# EAGLE board DAM1941 (EAGLE 9.3.1)
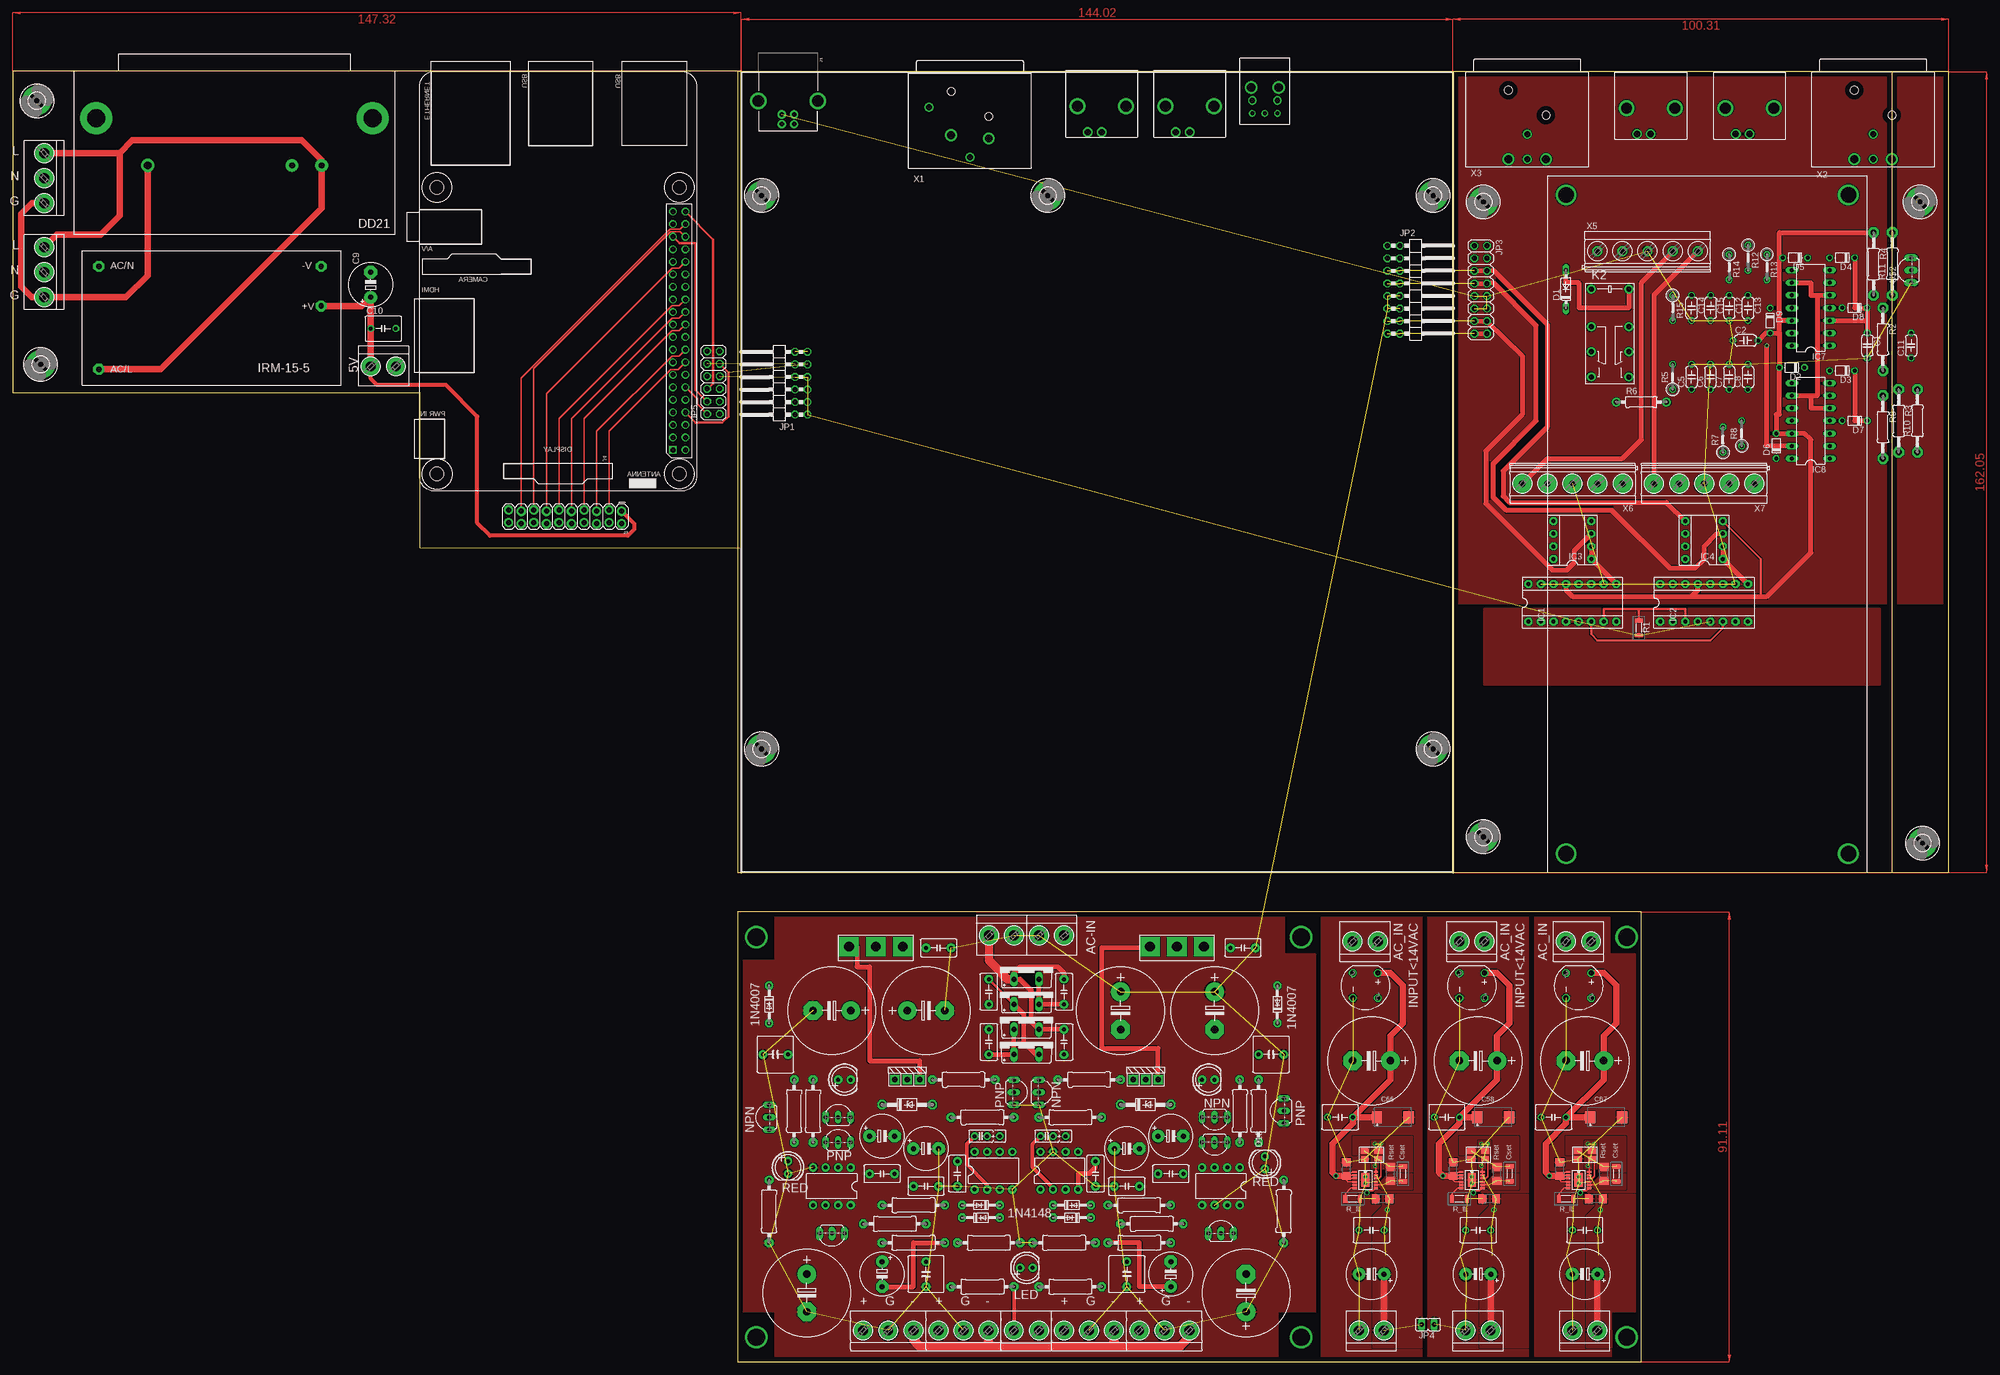
[diagram p7: board, top side]
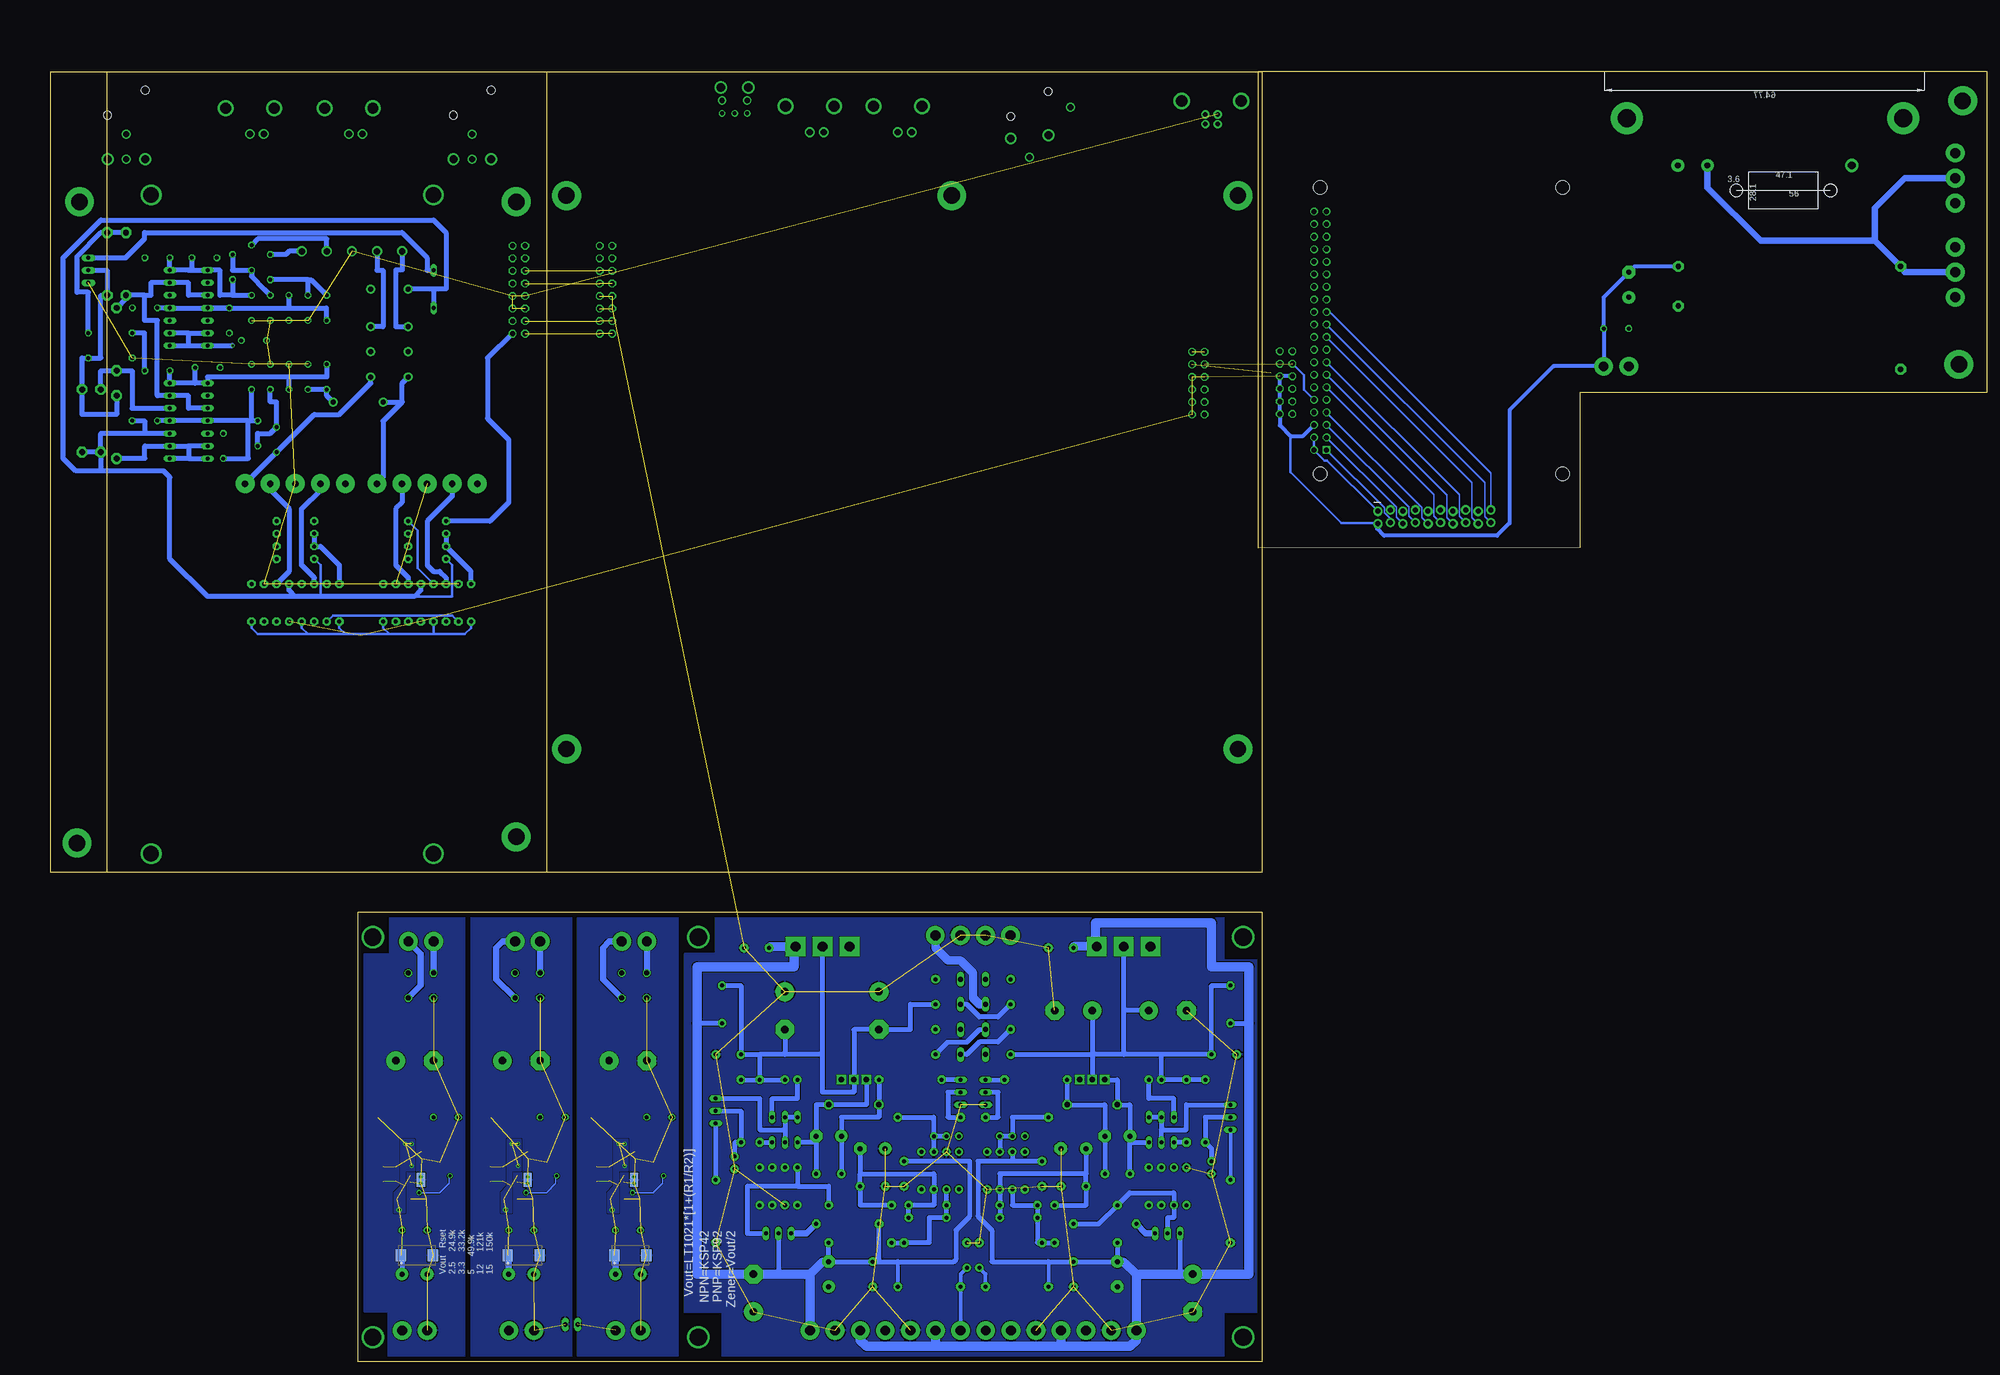
[diagram p8: board, bottom side, seen from below]

Size 391.77 x 261.24 mm. Coordinates in mm from the lower left corner, seen from the top.
Outline: 146.68,99.06 380.34,99.06 380.34,261.11 146.68,261.11 146.68,99.06
Outline: 291.46,99.06 391.77,99.06 391.77,261.11 291.46,261.11 291.46,99.06
Outline: 147.32,261.24 0,261.24 0,196.24 82.32,196.24 82.32,164.81 147.32,164.72 147.32,261.24
Outline: 146.68,0 329.6,0 329.6,91.11 146.68,91.11 146.68,0
Copper layers (1*16): Top 0.035mm / dielectric 1.5mm / Bottom 0.035mm
Design rules "default": minimum track width 6mil, minimum drill 0.35mm, track to track 6mil, track to pad 6mil, pad to pad 6mil, via to via 6mil, smd to smd 6mil, copper to edge 40mil, drill to drill 6mil, minimum pad ring 10mil, minimum via ring 8mil, stop-mask expansion 4mil, vias tented up to drill 0mil, thermal gap 10mil

## Footprints (pad centres in the part's own frame; a part is rotated, then mirrored left to right if it is on the bottom)
RB1A = drill 1.016: + -2.54,2.54 | drill 1.016 octagon: - 2.54,-2.54; AC1 2.54,2.54; AC2 -2.54,-2.54
C050-024X044 = drill 0.813 octagon: 1 -2.54,0; 2 2.54,0
C050-035X075 = drill 0.813 pad 1.778: 1 -2.54,0; 2 2.54,0
E5-8,5 = drill 1.016 pad 2.54: + -2.54,0 | drill 1.016 pad 2.54 octagon: - 2.54,0
C050-050X075 = drill 0.813 octagon: 1 -2.54,0; 2 2.54,0
C025_050-025X075 = drill 0.813 pad 1.524: 1 -1.27,0; 2 1.27,0; 3 3.81,0
C050-075X075 = drill 0.813 pad 1.778: 1 -2.54,0; 2 2.54,0
E7,5-18 = drill 1.5 pad 3.81: + -3.81,0 | drill 1.5 pad 3.81 octagon: - 3.81,0
C1206 = smd 1.6 x 1.8: 1 -1.4,0; 2 1.4,0
E5-10,5 = drill 1.016 pad 2.54: + -2.54,0; - 2.54,0
SP-CAP-CX = smd 2.062 x 2.4: + -2.754,0; - 3.707,0
DO35-7 = drill 0.813 long: A 3.81,0; C -3.81,0
D-5 = drill 0.813 octagon: A 2.54,0; C -2.54,0
LED5MM = drill 0.813 pad 1.676: A -1.27,0; K 1.27,0
DO41Z10 = drill 1.118 pad 1.93 octagon: A 5.08,0; C -5.08,0
1N4148 = drill 0.813 pad 1.676 octagon: A 3.81,0; C -3.81,0
DIL08 = drill 0.813 pad 1.676: 1 -3.81,-3.81; 2 -1.27,-3.81; 3 1.27,-3.81; 4 3.81,-3.81; 5 3.81,3.81; 6 1.27,3.81; 7 -1.27,3.81; 8 -3.81,3.81
TO220ACS = drill 1.016 long: A 2.54,-2.54; C -2.54,-2.54
3,3-PAD = drill 3.3 pad 5.842: B3,3 0,0
DIL16 = drill 0.813 pad 1.676 octagon: 1 -8.89,-3.81; 2 -6.35,-3.81; 3 -3.81,-3.81; 4 -1.27,-3.81; 5 1.27,-3.81; 6 3.81,-3.81; 7 6.35,-3.81; 8 8.89,-3.81; 9 8.89,3.81; 10 6.35,3.81; 11 3.81,3.81; 12 1.27,3.81; 13 -1.27,3.81; 14 -3.81,3.81; 15 -6.35,3.81; 16 -8.89,3.81
DIL08' = drill 0.813 pad 1.6 octagon: 1 -3.81,-3.81; 2 -1.27,-3.81; 3 1.27,-3.81; 4 3.81,-3.81; 5 3.81,3.81; 6 1.27,3.81; 7 -1.27,3.81; 8 -3.81,3.81
DIL14 = drill 0.813 long: 1 -7.62,-3.81; 2 -5.08,-3.81; 3 -2.54,-3.81; 4 0,-3.81; 5 2.54,-3.81; 6 5.08,-3.81; 7 7.62,-3.81; 8 7.62,3.81; 9 5.08,3.81; 10 2.54,3.81; 11 0,3.81; 12 -2.54,3.81; 13 -5.08,3.81; 14 -7.62,3.81
USB-B-PTH = drill 0.914 pad 1.676: D+ 4,1.25; D- 5.981,1.25; GND 4,-1.25; VBUS 5.981,-1.25 | drill 2.286: SHLD1 1.282,-6.02; SHLD2 1.282,6.02
2X10_LOCK = drill 1.016 pad 1.88: 1 0,0.127; 2 0,2.667; 3 2.54,-0.127; 4 2.54,2.413; 5 5.08,0.127; 6 5.08,2.667; 7 7.62,-0.127; 8 7.62,2.413; 9 10.16,0.127; 10 10.16,2.667; 11 12.7,-0.127; 12 12.7,2.413; 13 15.24,0.127; 14 15.24,2.667; 15 17.78,-0.127; 16 17.78,2.413; 17 20.32,0.127; 18 20.32,2.667; 19 22.86,-0.127; 20 22.86,2.413
2X06/90 = drill 1.016 octagon: 1 -6.35,-6.35; 2 -6.35,-3.81; 3 -3.81,-6.35; 4 -3.81,-3.81; 5 -1.27,-6.35; 6 -1.27,-3.81; 7 1.27,-6.35; 8 1.27,-3.81; 9 3.81,-6.35; 10 3.81,-3.81; 11 6.35,-6.35; 12 6.35,-3.81
2X08/90 = drill 1.016 octagon: 1 -8.89,-6.35; 2 -8.89,-3.81; 3 -6.35,-6.35; 4 -6.35,-3.81; 5 -3.81,-6.35; 6 -3.81,-3.81; 7 -1.27,-6.35; 8 -1.27,-3.81; 9 1.27,-6.35; 10 1.27,-3.81; 11 3.81,-6.35; 12 3.81,-3.81; 13 6.35,-6.35; 14 6.35,-3.81; 15 8.89,-6.35; 16 8.89,-3.81
2X08 = drill 1.016 octagon: 1 -8.89,-1.27; 2 -8.89,1.27; 3 -6.35,-1.27; 4 -6.35,1.27; 5 -3.81,-1.27; 6 -3.81,1.27; 7 -1.27,-1.27; 8 -1.27,1.27; 9 1.27,-1.27; 10 1.27,1.27; 11 3.81,-1.27; 12 3.81,1.27; 13 6.35,-1.27; 14 6.35,1.27; 15 8.89,-1.27; 16 8.89,1.27
JP1 = drill 0.914 long: 1 0,-1.27; 2 0,1.27
2X06 = drill 1.016 octagon: 1 -6.35,-1.27; 2 -6.35,1.27; 3 -3.81,-1.27; 4 -3.81,1.27; 5 -1.27,-1.27; 6 -1.27,1.27; 7 1.27,-1.27; 8 1.27,1.27; 9 3.81,-1.27; 10 3.81,1.27; 11 6.35,-1.27; 12 6.35,1.27
G5V-2 = drill 1 pad 1.8: 1 -8.89,-3.81; 4 -1.27,-3.81; 6 3.81,-3.81; 8 8.89,-3.81; 9 8.89,3.81; 11 3.81,3.81; 13 -1.27,3.81; 16 -8.89,3.81
RPI3 = drill 1.016 square: P$1 8.37,51.23 | drill 1.016: P$2 8.357,53.772; P$3 10.897,51.232; P$4 10.897,53.772; P$5 13.437,51.232; P$6 13.437,53.772; P$7 15.977,51.232; P$8 15.977,53.772; P$9 18.517,51.232; P$10 18.517,53.772; P$11 21.057,51.232; P$12 21.057,53.772; P$13 23.597,51.232; P$14 23.597,53.772; P$15 26.137,51.232; P$16 26.137,53.772; P$17 28.677,51.232; P$18 28.677,53.772; P$19 31.217,51.232; P$20 31.217,53.772; P$21 33.757,51.232; P$22 33.757,53.772; P$23 36.297,51.232; P$24 36.297,53.772; P$25 38.837,51.232; P$26 38.837,53.772; P$27 41.377,51.232; P$28 41.377,53.772; P$29 43.917,51.232; P$30 43.917,53.772; P$31 46.457,51.232; P$32 46.457,53.772; P$33 48.997,51.232; P$34 48.997,53.772; P$35 51.537,51.232; P$36 51.537,53.772; P$37 54.077,51.232; P$38 54.077,53.772; P$39 56.617,51.232; P$40 56.617,53.772 | hole 2.75: 3.5,3.5; 61.5,3.5; 3.5,52.5; 61.5,52.5
TO92-EBC = drill 0.813 long: B 0,-1.27; C 2.54,-1.27; E -2.54,-1.27
TO-264 = drill 2 pad 4 square: B -5.45,-6.096; C 0,-6.096; E 5.45,-6.096
TO220KG = drill 1.1 pad 1.93 square: 1 -2.54,0; 2 0,0; 3 2.54,0
TO92- = drill 0.813 pad 1.422 long: 1 2.54,0; 2 0,0; 3 -2.54,0
MINI_MELF-0204R = smd 0.8 x 1.6: 1 -1.5,0; 2 1.5,0
0207/12 = drill 1.2 pad 2.184 octagon: 1 -6.35,0; 2 6.35,0
0207/5V = drill 0.813 octagon: 1 -2.54,0; 2 2.54,0
0207/10 = drill 1 pad 1.778: 1 -5.08,0; 2 5.08,0
0309/12 = drill 0.813 pad 1.778 octagon: 1 -6.35,0; 2 6.35,0
RCA = drill 1.3: 1_+ 0,0; 2_G -2.8,0 | drill 2.2: 3_NC -4.9,5.25; 4_NC 4.9,5.25
TORX147 = drill 0.8: 1_VOUT -2.54,0; 2_GND 0,0; 3_VCC 2.54,0 | drill 1.1: 4_NC -2.54,2.625; 5_NC 2.54,2.625 | drill 1.7: P$1 -2.8,5.235; P$2 2.8,5.235
DYNALO17_DRILL = drill 3.2 pad 3.81: P$1 3.81,60.96; P$2 3.81,3.81; P$3 137.16,3.81; P$4 137.16,60.96
MSOP12 = smd 0.9 x 0.42: 1 -2.163,1.625; 2 -2.163,0.975; 3 -2.163,0.325; 4 -2.163,-0.325; 5 -2.163,-0.975; 6 -2.163,-1.625; 7 2.15,-1.625; 8 2.15,-0.975; 9 2.15,-0.325; 10 2.15,0.325; 11 2.15,0.975; 12 2.15,1.625 | smd 1.65 x 2.85: EXP 0,0 | smd 1.65 x 2.85 bottom: EXP1 0,0
DD21.NOCOVER = drill 1.2 pad 2.54: L 14.85,19.05; N 20.85,19.05 | drill 3.6 pad 6.452: P$1 4.5,9.5; P$2 60.5,9.5 | drill 1.6 pad 2.7: PE 50.05,19.05
LT3045CAP = smd 1.6 x 1.143: 3 -1.394,0.767; 4 -1.4,-0.776; 5 1.402,0.776; 6 1.403,-0.767
IRM-15 = drill 1.1 pad 2.184 octagon: +V 48.4,16; -V 48.4,24; AC/L 3.4,3.2; AC/N 3.4,24
NC3FAH2-0 = drill 1.6: 1 -3.81,0.635; 2 3.81,0 | drill 1.2: 3 0,-3.815; G -8.25,6.355 | hole 1.6: -3.81,9.525; 3.81,4.445
NC3MBH-B = drill 1.6: 1 3.81,0; 2 -3.81,0 | drill 1.2: 3 0,0; G 0,5.08 | hole 1.6: -3.81,13.97; 3.81,8.89
MKDSN1,5/3-5,08 = drill 2 pad 3.81: 1 -7.641,0.025; 2 -2.561,0.025; 3 2.519,0.025
MKDSN1,5/5-5,08 = drill 1.3 pad 2: 1 -10.181,0.025; 2 -5.101,0.025; 3 -0.021,0.025; 4 5.059,0.025; 5 10.139,0.025
MKDSN1,5/5-5,08' = drill 1.3 pad 3.81: 1 -10.181,0.025; 2 -5.101,0.025; 3 -0.021,0.025; 4 5.059,0.025; 5 10.139,0.025
CON-PHOENIX-508_MKDSN1,5/3-5,08 = drill 2 pad 3.81: 1 -7.641,0.025; 2 -2.561,0.025; 3 2.519,0.025
CON-PHOENIX-508_MKDSN1,5/2-5,08 = drill 2 pad 3.81: 1 -2.561,0.025; 2 2.519,0.025
MKDSN1,5/2-5,08 = drill 2 pad 3.81: 1 -2.561,0.025; 2 2.519,0.025

## Placement (x,y rotation side)
B1  [RB1A]  273.68,76.2 270 top
B3  [RB1A]  295.27,76.2 270 top
B5  [RB1A]  316.86,76.2 270 top
C1  [C050-024X044]  375.28,205.74 270 top
C2  [C050-024X044]  350.65,206.76 0 top
C3  [C050-035X075]  175.89,38.1 0 top
C4  47uF  [E5-8,5]  175.89,45.72 0 top
C5  [C050-024X044]  339.72,199.39 90 top
C6  [C050-024X044]  343.53,199.39 90 top
C7  [C050-024X044]  347.34,199.39 90 top
C8  [C050-024X044]  351.15,199.39 90 top
C9  [E5-8,5]  72.39,218.06 90 top
C10  [C050-050X075]  74.93,209.17 0 top
C11  [C050-024X044]  384.17,205.74 90 top
C12  [C050-024X044]  347.34,213.36 270 top
C13  [C050-024X044]  351.15,213.36 270 top
C14  [C050-024X044]  339.72,213.36 270 top
C15  [C050-024X044]  343.58,213.36 270 top
C16  47uF  [E5-8,5]  234.31,45.72 0 top
C17  [C050-035X075]  234.31,38.1 0 top
C18  47uF  [E5-8,5]  184.78,43.18 0 top
C19  [C050-035X075]  184.78,35.56 180 top
C20  47p  [C025_050-025X075]  195.9,45.72 0 top
C21  [C050-035X075]  225.42,35.56 0 top
C22  47uF  [E5-8,5]  225.42,43.18 0 top
C23  47p  [C025_050-025X075]  209.23,45.72 0 top
C24  10uF  [E5-8,5]  234.31,17.78 90 top
C25  10uF  [E5-8,5]  175.89,17.78 270 top
C26  4.7uF  [C050-075X075]  184.78,17.78 90 top
C27  [E7,5-18]  160.65,13.97 270 top
C28  [E7,5-18]  249.55,13.97 90 top
C29  4.7uF  [C050-075X075]  225.42,17.78 270 top
C30  [C050-035X075]  219.07,38.1 270 top
C31  [C050-035X075]  191.13,38.1 90 top
C32  [C050-035X075]  248.92,83.82 180 top
C33  [C050-075X075]  254.63,62.23 180 top
C34  [C050-075X075]  154.3,62.23 180 top
C35  [C050-035X075]  187.32,83.82 0 top
C36  [C050-035X075]  197.48,64.77 270 top
C37  [C050-035X075]  212.72,74.93 90 top
C38  [C050-035X075]  212.72,64.77 270 top
C39  [C050-035X075]  197.48,74.93 90 top
C40  [E7,5-18]  165.73,71.12 180 top
C41  [E7,5-18]  184.78,71.12 0 top
C42  [E7,5-18]  224.15,71.12 270 top
C43  [E7,5-18]  243.2,71.12 270 top
C44  [E7,5-18]  274.95,60.96 180 top
C45  [C1206]  278.76,38.1 90 top
C46  [C050-050X075]  268.6,49.53 180 top
C47  [C050-050X075]  274.95,26.67 180 top
C48  [E5-10,5]  274.95,17.78 180 top
C49  [C1206]  269.88,39.05 90 top
C50  [C1206]  277.18,33.02 180 top
C51  [E7,5-18]  296.54,60.96 180 top
C52  [C1206]  300.35,38.1 90 top
C53  [C050-050X075]  290.19,49.53 180 top
C54  [C050-050X075]  296.54,26.67 180 top
C55  [E5-10,5]  296.54,17.78 180 top
C56  [C1206]  291.46,39.05 90 top
C57  [C1206]  298.77,33.02 180 top
C58  [SP-CAP-CX]  299.08,49.53 0 top
C59  [E7,5-18]  318.13,60.96 180 top
C60  [C1206]  321.94,38.1 90 top
C61  [C050-050X075]  311.78,49.53 180 top
C62  [C050-050X075]  318.13,26.67 180 top
C63  [E5-10,5]  318.13,17.78 180 top
C64  [C1206]  313.05,39.05 90 top
C65  [C1206]  320.36,33.02 180 top
C66  [SP-CAP-CX]  278.76,49.53 0 top
C67  [SP-CAP-CX]  321.94,49.53 0 top
C68  [SP-CAP-CX]  318.13,21.59 0 bottom
C69  [SP-CAP-CX]  274.95,21.59 0 bottom
C70  [SP-CAP-CX]  296.54,21.59 0 bottom
D1  1N4148DO35-7  [DO35-7]  314.32,217.17 90 top
D2  [D-5]  360.02,201.27 180 top
D3  [D-5]  370.2,200.66 180 top
D4  [D-5]  370.2,223.52 180 top
D5  [D-5]  360.68,223.52 180 top
D6  [D-5]  356.87,185.42 90 top
D7  [D-5]  372.75,190.5 180 top
D8  [D-5]  372.72,213.38 180 top
D9  [D-5]  355.62,210.8 270 top
D10  [LED5MM]  168.27,57.15 0 top
D11  [LED5MM]  241.93,57.15 0 top
D12  1N4728  [DO41Z10]  180.97,52.07 0 top
D13  [LED5MM]  253.36,40.32 90 top
D14  [LED5MM]  156.84,39.37 270 top
D15  1N4728  [DO41Z10]  229.23,52.07 0 top
D16  1N4148-V  [1N4148]  255.9,72.39 90 top
D17  1N4148-V  [1N4148]  153.03,72.39 270 top
D18  LT1021  [DIL08]  244.47,35.56 180 top
D19  LT1021  [DIL08]  165.73,35.56 180 top
D20  1N4148-V  [1N4148]  214.31,31.75 0 top
D21  1N4148-V  [1N4148]  214.31,29.21 180 top
D22  1N4148-V  [1N4148]  195.9,31.75 180 top
D23  1N4148-V  [1N4148]  195.9,29.21 0 top
D24  [LED5MM]  205.1,19.05 0 top
D25  MUR810  [TO220ACS]  205.1,64.77 0 top
D26  MUR810  [TO220ACS]  205.1,80.01 0 top
D27  MUR810  [TO220ACS]  205.1,69.85 0 top
D28  MUR810  [TO220ACS]  205.1,74.93 0 top
H1  MOUNT-PAD-ROUND3.3  [3,3-PAD]  287.4,124.08 0 top
H2  MOUNT-PAD-ROUND3.3  [3,3-PAD]  151.51,124.08 0 top
H3  MOUNT-PAD-ROUND3.3  [3,3-PAD]  151.51,236.09 0 top
H4  MOUNT-PAD-ROUND3.3  [3,3-PAD]  287.4,236.09 0 top
H5  MOUNT-PAD-ROUND3.3  [3,3-PAD]  209.42,236.09 0 top
H6  MOUNT-PAD-ROUND3.3  [3,3-PAD]  297.56,106.3 0 top
H7  MOUNT-PAD-ROUND3.3  [3,3-PAD]  386.46,105.03 0 top
H8  MOUNT-PAD-ROUND3.3  [3,3-PAD]  297.56,234.82 0 top
H9  MOUNT-PAD-ROUND3.3  [3,3-PAD]  385.95,234.82 0 top
H12  MOUNT-PAD-ROUND3.3  [3,3-PAD]  4.83,255.27 0 top
H13  MOUNT-PAD-ROUND3.3  [3,3-PAD]  5.59,201.93 0 top
IC1  PGA2311P  [DIL16]  315.59,153.67 0 top
IC2  PGA2311P  [DIL16]  342.26,153.67 0 top
IC3  OPA2131P  [DIL08']  315.59,166.37 90 top
IC4  OPA2131P  [DIL08']  342.26,166.37 90 top
IC5  OPA134  [DIL08]  198.44,38.73 0 top
IC6  OPA134  [DIL08]  211.77,38.73 0 top
IC7  LM339N  [DIL14]  363.85,213.36 90 top
IC8  LM339N  [DIL14]  363.85,190.5 90 top
J1  USB_B_PTH  [USB-B-PTH]  156.84,256.54 270 top
J3  [2X10_LOCK]  123.19,172.34 180 top
JP1  [2X06/90]  154.43,198.12 90 top
JP2  [2X08/90]  284.48,217.04 270 top
JP3  [2X08]  297.03,217.04 270 top
JP4  [JP1]  286.38,7.62 90 top
JP5  [2X06]  141.75,198.25 90 top
K2  G5V-2  [G5V-2]  323.21,208.28 270 top
PCB2  RPI3  [RPI3]  82.32,176.24 90 bottom
Q1  [TO92-EBC]  167,50.8 0 top
Q2  [TO92-EBC]  243.2,48.26 180 top
Q3  [TO92-EBC]  167,45.72 0 top
Q4  MJW21194  [TO-264]  174.62,90.17 0 top
Q5  MJE15031  [TO220KG]  229.23,57.15 0 top
Q6  [TO92-EBC]  203.83,54.61 270 top
Q7  MJW21193  [TO-264]  235.58,90.17 0 top
Q8  DN2540  [TO92-]  165.73,26.03 180 top
Q9  MJE15030  [TO220KG]  180.97,57.15 0 top
Q10\  [TO92-EBC]  243.2,43.18 180 top
Q11  [TO92-EBC]  208.91,54.61 270 top
Q12  DN2540  [TO92-]  244.47,26.03 0 top
Q13  [TO92-EBC]  255.9,50.8 90 top
Q14  [TO92-EBC]  151.76,49.53 90 top
R1  100k  [MINI_MELF-0204R]  329.06,148.59 270 top
R2  500  [0207/12]  378.46,207.01 270 top
R3  11K  [0207/12]  381.63,190.5 270 top
R4  11K  [0207/12]  376.55,222.25 270 top
R5  100K  [0207/5V]  335.91,199.39 90 top
R6  100K  [0207/10]  329.56,194.31 0 top
R7  100K  [0207/5V]  346.07,186.69 90 top
R8  100K  [0207/5V]  349.88,187.96 90 top
R9  1K  [0207/12]  378.46,189.23 270 top
R10  100K  [0207/12]  385.44,190.5 90 top
R11  500K  [0207/12]  380.37,222.25 90 top
R12  100K  [0207/5V]  351.15,223.52 270 top
R13  100K  [0207/5V]  354.96,221.62 270 top
R14  100K  [0207/5V]  347.34,221.62 270 top
R15  100K  [0207/5V]  335.91,213.36 270 top
R16  150  [0309/12]  161.92,50.8 270 top
R17  1k  [0309/12]  153.03,30.48 270 top
R18  10  [0309/12]  192.4,57.15 0 top
R19  150  [0309/12]  248.28,50.8 90 top
R20  1k  [0309/12]  257.17,30.48 90 top
R21  10k  [0309/12]  158.11,50.8 270 top
R22  10k  [0309/12]  252.09,50.8 90 top
R23  10  [0309/12]  217.8,57.15 0 top
R24  10  [0309/12]  213.99,49.53 180 top
R25  10  [0309/12]  196.21,49.53 0 top
R26  R2  [0309/12]  197.48,24.13 180 top
R27  R1  [0309/12]  182.24,24.13 180 top
R28  R11  [0309/12]  227.96,24.13 180 top
R29  R12  [0309/12]  212.72,24.13 180 top
R30  1k  [0309/12]  178.43,27.94 180 top
R31  1k  [0309/12]  230.5,27.94 0 top
R32  RLED  [0309/12]  196.21,15.24 180 top
R33  RLED  [0309/12]  213.99,15.24 180 top
R34  500  [0309/12]  182.24,31.75 180 top
R35  500  [0309/12]  227.96,31.75 0 top
R36  [MINI_MELF-0204R]  281.3,38.1 270 top
R37  [MINI_MELF-0204R]  271.14,33.02 180 top
R38  [MINI_MELF-0204R]  302.89,38.1 270 top
R39  [MINI_MELF-0204R]  292.73,33.02 180 top
R40  [MINI_MELF-0204R]  324.48,38.1 270 top
R41  [MINI_MELF-0204R]  314.32,33.02 180 top
RCA1  RCA  [RCA]  220.34,248.92 0 top
RCA2  RCA  [RCA]  238.12,248.92 0 top
RCA3  RCA  [RCA]  331.46,248.56 0 top
RCA4  RCA  [RCA]  351.46,248.56 0 top
U$1  TORX147  [TORX147]  253.36,252.73 0 top
U$2  2N7000  [TO92-]  384.17,220.98 90 top
U$3  DYNALO_DRILL  [DYNALO17_DRILL]  375.28,99.06 90 top
U$4  LT3045  [MSOP12]  273.68,36.83 0 top
U$5  DD21  [DD21.NOCOVER]  77.32,261.24 180 top
U$6  LT3045CAP  [LT3045CAP]  274.95,41.91 180 top
U$7  IRM-15-5  [IRM-15]  13.97,197.74 0 top
U$8  LT3045  [MSOP12]  295.27,36.83 0 top
U$9  LT3045CAP  [LT3045CAP]  296.54,41.91 180 top
U$10  LT3045  [MSOP12]  316.86,36.83 0 top
U$11  LT3045CAP  [LT3045CAP]  318.13,41.91 180 top
X1  NC3FAH2-0  [NC3FAH2-0]  193.67,247.65 0 top
X2  NC3MBH-B  [NC3MBH-B]  376.46,243.46 0 top
X3  NC3MBH-B  [NC3MBH-B]  306.46,243.46 0 top
X4  MKDSN1,5/3-5,08  [MKDSN1,5/3-5,08]  235.58,6.35 0 top
X5  MKDSN1,5/5-5,08  [MKDSN1,5/5-5,08]  330.83,224.79 0 top
X6  MKDSN1,5/5-5,08  [MKDSN1,5/5-5,08']  315.59,177.8 180 top
X7  MKDSN1,5/5-5,08  [MKDSN1,5/5-5,08']  342.26,177.8 180 top
X8  MKDSN1,5/3-5,08  [MKDSN1,5/3-5,08]  220.34,6.35 0 top
X9  MKDSN1,5/3-5,08  [MKDSN1,5/3-5,08]  194.94,6.35 0 top
X10  CON-PHOENIX-508_MKDSN1,5/3-5,08  [CON-PHOENIX-508_MKDSN1,5/3-5,08]  6.35,242.19 90 top
X11  CON-PHOENIX-508_MKDSN1,5/3-5,08  [CON-PHOENIX-508_MKDSN1,5/3-5,08]  6.35,223.14 90 top
X12  CON-PHOENIX-508_MKDSN1,5/2-5,08  [CON-PHOENIX-508_MKDSN1,5/2-5,08]  74.93,201.55 180 top
X13  MKDSN1,5/3-5,08  [MKDSN1,5/3-5,08]  179.7,6.35 0 top
X14  MKDSN1,5/2-5,08  [MKDSN1,5/2-5,08]  205.1,6.35 0 top
X15  MKDSN1,5/2-5,08  [MKDSN1,5/2-5,08]  200.02,86.36 180 top
X16  MKDSN1,5/2-5,08  [MKDSN1,5/2-5,08]  210.18,86.36 180 top
X17  CON-PHOENIX-508_MKDSN1,5/2-5,08  [CON-PHOENIX-508_MKDSN1,5/2-5,08]  273.68,85.09 0 top
X18  CON-PHOENIX-508_MKDSN1,5/2-5,08  [CON-PHOENIX-508_MKDSN1,5/2-5,08]  274.95,6.35 0 top
X19  CON-PHOENIX-508_MKDSN1,5/2-5,08  [CON-PHOENIX-508_MKDSN1,5/2-5,08]  295.27,85.09 0 top
X20  CON-PHOENIX-508_MKDSN1,5/2-5,08  [CON-PHOENIX-508_MKDSN1,5/2-5,08]  296.54,6.35 0 top
X21  CON-PHOENIX-508_MKDSN1,5/2-5,08  [CON-PHOENIX-508_MKDSN1,5/2-5,08]  316.86,85.09 0 top
X22  CON-PHOENIX-508_MKDSN1,5/2-5,08  [CON-PHOENIX-508_MKDSN1,5/2-5,08]  318.13,6.35 0 top

## Tracks (layer width: path | path; a pad name or v marks a point on that pad's centre or on a via)
3
  Bottom 0.254: J3.6 119.43,170.99 119.43,173.01 PCB2.P$3
3V3
  Bottom 0.254: J3.4 120.65,170.74 121.87,171.96 121.87,172.93 PCB2.P$1
5
  Bottom 0.254: J3.8 116.89,171.25 116.89,173.01 PCB2.P$5
5V
  Top 0.813: J3.1 125.73,169.67 125.73,168.53 124.46,167.26 96.52,167.26 93.98,169.8 93.98,191.39 87.63,197.74 73.66,197.74 72.39,199.01 72.39,201.55
  Top 1.27: U$7.+V 70.61,213.74 C9.+ C10.1 72.39,201.55 X12.2
  Bottom 0.508: J3.1 133.48,182.5 133.99,182.5 PCB2.P$2 PCB2.P$4
7
  Bottom 0.254: J3.10 114.25,170.89 114.25,172.91 PCB2.P$7
11
  Bottom 0.254: J3.12 111.81,171.25 111.81,175.56 PCB2.P$11
13
  Bottom 0.254: J3.14 109.17,170.89 109.17,175.45 PCB2.P$13
15
  Bottom 0.254: J3.16 106.73,171.25 106.73,175.56 PCB2.P$15
19
  Bottom 0.254: PCB2.P$19 104.14,178.04 104.14,170.94 J3.18
21
  Bottom 0.254: PCB2.P$21 101.55,177.99 101.55,171.14 J3.20
23
  Bottom 0.254: J3.19 100.33,179.96 132.91,212.54 PCB2.P$23
A+5V
  Top 1.016: D3.C 372.75,190.5 D7.C | D4.C 372.75,213.36 375.24,213.36 D8.C 375.26,210.84 375.28,210.82 | 375.28,210.82 C1.1 | IC7.3 375.28,210.82
  Bottom 0.508: IC4.8 337.18,161.29 337.18,154.94 | IC3.8 310.51,161.29 310.51,154.94 318.13,154.94
  Bottom 1.016: 314.32,217.15 D1.C | 314.32,217.15 314.34,217.17 K2.1 | D3.C 372.76,200.68 372.76,208.28 C1.1 | 372.76,187.96 381.65,187.96 381.63,187.94 R3.2 | D7.C 372.76,190.5 372.76,187.96 | R3.2 R10.1 | R3.2 381.63,180.34 | 381.63,180.34 386.71,180.34 389.25,182.88 389.25,223.52 381.63,231.14 314.32,231.14 311.78,228.6 311.78,217.17 314.3,217.17 314.32,217.15 | IC1.12 316.86,156.21 318.13,154.94 337.18,154.94 342.26,154.94 | 342.26,154.94 343.53,156.21 IC2.12 | 342.26,154.94 360.04,154.94 367.66,162.56 367.66,179.07 368.93,180.34 381.63,180.34 | IC8.3 372.76,187.96
A-5V
  Top 0.508: IC4.4 353.69,162.56 353.69,154.94
  Top 1.016: 357.48,208.28 357.48,210.82 | 357.48,210.82 357.48,223.52 | 357.48,223.52 357.48,228.56 357.52,228.6 R4.1 | 357.48,208.28 D2.A 357.5,201.25 357.5,191.77 356.87,191.77 D6.A IC8.12 362.58,187.96 363.85,186.69 363.85,163.83 354.96,154.94 353.69,154.94 339.72,154.94 | IC7.12 357.48,210.82 | 357.48,208.28 357.46,208.26 D9.A 354.69,208.26 C2.2 | D5.A 357.48,223.52 | IC1.13 314.32,156.21 315.59,154.94 339.72,154.94 | 339.72,154.94 341,156.21 IC2.13
  Bottom 0.508: IC3.4 317.5,168.28 317.5,160.66 IC1.13
  Bottom 1.016: R4.1 R11.2 381.63,228.6 386.46,223.77 386.46,216.53 384.17,216.53 C11.2
AGND  (39 unrouted)
  pour Top: 154.3,92.71 257.17,92.71 257.22,82.55 263.52,82.55 263.52,10.16 255.9,10.16 255.9,0 154.3,0 154.3,10.16 145.41,10.16 145.41,81.28 154.3,81.28
  pour Bottom: 145.41,81.28 154.3,81.28 154.3,92.71 257.17,92.71 257.17,82.55 263.52,82.55 263.52,10.16 255.9,10.16 255.9,0 154.3,0 154.3,10.16 145.41,10.16
COM+
  Top 1.016: IC8.9 363.85,195.58 | 363.85,195.58 363.85,193.04 IC8.5 | 363.85,195.58 365.12,195.58 365.12,215.9 | 365.12,215.9 IC7.5 | IC7.9 363.85,218.44 363.85,215.9 365.12,215.9
  Bottom 1.016: R3.1 381.63,200.64 381.65,200.66 R2.2 375.3,200.66 375.3,193.04 IC8.5
COM-
  Bottom 1.016: IC8.10 363.88,193.04 363.88,195.58 IC8.6 370.22,195.58 370.22,210.82 372.76,210.82 372.76,215.9 | IC7.10 363.88,215.9 363.88,218.44 IC7.6 371.5,218.44 371.5,215.9 372.76,215.9 | 372.76,215.9 R4.2 376.55,215.26 R2.1
D+5V
  Bottom 0.508: IC1.1 306.7,148.59 307.97,147.32 314.32,147.32 | 323.21,147.32 324.48,148.59 IC1.8 | 314.32,147.32 323.21,147.32 | IC1.4 314.32,147.32 | 323.21,147.32 332.1,147.32 | 332.1,147.32 333.38,148.59 IC2.1 | 332.1,147.32 339.72,147.32 | 339.72,147.32 341,148.59 IC2.4 | 339.72,147.32 349.88,147.32 351.15,148.59 IC2.8
DGND  (8 unrouted)
  Bottom 0.508: J3.2 123.32,169.8 130.57,169.8 140.85,180.08 140.85,187.46
  Bottom 0.813: PCB2.P$6 138.31,187.46 140.85,187.46 143.02,189.63 JP5.1 JP5.3 JP5.5 JP5.7 JP5.8 | U$7.-V 71.25,221.74 C9.- 77.47,215.52 C10.2 77.47,201.55 X12.1 87.65,201.52 96.52,192.66 96.52,169.8 99.06,167.26 121.92,167.26 123.32,168.66 123.32,169.8
  pour Top: 297.81,152.4 377.82,152.4 377.82,137.16 297.81,137.16
DYNALO_LEFT+
  Bottom 1.016: R6.1 320.67,194.31 | 320.67,194.31 320.65,194.31 320.65,198.14 K2.8 | X6.1 324.51,179.05 324.51,190.48 320.67,194.31
DYNALO_LEFT-
  Top 1.016: X6.5 310.56,182.88 325.75,182.88 329.56,186.69 329.56,218.44 335.89,224.77 X5.4
  Bottom 1.016: 335.89,224.75 X5.4 335.89,227.29 335.93,227.33 349.88,227.33 R12.1
DYNALO_RIGHT+
  Bottom 1.016: K2.9 327.02,198.12 333.38,191.77 338.45,191.77 R7.1 349.88,180.34 X7.1
DYNALO_RIGHT-
  Top 1.016: X7.5 332.1,177.8 332.1,215.95 X5.5
  Bottom 1.016: 340.97,224.75 X5.5 343.53,224.81 344.19,224.16 R14.1
G7
  Top 0.254: J3.11 110.49,190.95 133.35,213.81 134.82,213.81 PCB2.P$26
G8
  Top 0.254: J3.9 113.03,190.95 133.35,211.27 134.82,211.27 PCB2.P$24
G12
  Top 0.254: J3.13 107.95,196.03 133.35,221.43 134.82,221.43 PCB2.P$32
G16
  Top 0.254: J3.15 105.41,201.11 133.12,228.82 135.05,228.82 PCB2.P$36
G20
  Top 0.254: J3.17 102.87,199.14 133,229.27 135.05,229.27 PCB2.P$38
G23
  Top 0.254: PCB2.P$16 134.59,200.88 133.12,200.88 120.65,188.41 J3.3
G24
  Top 0.254: J3.5 118.11,188.41 133.35,203.65 134.82,203.65 PCB2.P$18
G25
  Top 0.254: J3.7 115.57,190.95 133.35,208.73 134.82,208.73 PCB2.P$22
GND  (22 unrouted)
  pour Top: 288.95,153.67 391.82,153.67 391.82,260.35 288.95,260.35
GND1  (via drill 0.4)  (16 unrouted)
  other vias: 273.68,37.47 273.68,36.2
  pour Top (rank 3): 264.79,92.71 264.79,0 285.11,0 285.11,92.71
  pour Bottom (rank 2): 264.79,92.71 264.79,0 285.11,0 285.11,92.71
GND2  (via drill 0.4)  (17 unrouted)
  other vias: 295.27,37.47 295.27,36.2
  pour Top (rank 3): 286.38,92.71 286.38,0 306.7,0 306.7,92.71
  pour Bottom (rank 2): 286.38,92.71 286.38,0 306.7,0 306.7,92.71
GND3  (via drill 0.4)  (16 unrouted)
  other vias: 316.86,37.47 316.86,36.2
  pour Top (rank 3): 307.97,92.71 307.97,0 323.53,0 323.53,10.16 328.29,10.16 328.29,82.55 323.21,82.55 323.21,92.71
  pour Bottom (rank 2): 307.97,92.71 307.97,0 323.53,0 323.53,10.16 328.29,10.16 328.29,82.55 323.21,82.55 323.21,92.71
  pour Bottom (rank 2): 307.97,92.71 307.97,0 323.53,0 323.53,10.16 328.29,10.16 328.29,82.55 323.21,82.55 323.21,92.71
I2SBCLK
  Top 0.508: PCB2.P$12 138.43,194.96 138.43,193.95 JP5.2
I2SDAT
  Top 0.508: PCB2.P$40 141.73,227.22 141.73,197.99 140.72,196.98 JP5.6
I2SLRCLK
  Top 0.508: PCB2.P$35 134.89,226.44 138.05,226.44 138.18,226.31 138.18,196.74 JP5.4
IN1  (via drill 0.61)
  Top 0.254: U$4.1 271.48,38.42 270.19,38.42 270.19,37.97 270.1,37.88 | 270.1,37.88 C49.1 270.37,37.16 U$4.3 | U$4.2 270.17,37.8 270.1,37.88 | U$4.4 270.2,36.51 269.88,36.83 270.1,37.05 270.1,37.88 | U$4.7 275.24,34.61 274.32,34.61 v274,34.29
  Top 1.27: C49.1 v267.78,37.65 267.02,38.42 267.02,44.13 271.14,48.26 C46.1 | C46.1 278.76,57.15 C44.+ 278.76,66.04 281.3,68.58 281.3,76.2 278.76,78.74 B1.+ | C66.+ C46.1
  Bottom 0.254: v274,34.29 269.88,34.29 267.97,36.2 267.97,37.47 v267.78,37.65
IN2  (via drill 0.61)
  Top 0.254: U$8.1 293.07,38.42 291.78,38.42 291.78,37.97 291.69,37.88 | 291.69,37.88 C56.1 291.96,37.16 U$8.3 | U$8.2 291.76,37.8 291.69,37.88 | U$8.4 291.79,36.51 291.46,36.83 291.69,37.05 291.69,37.88 | U$8.7 296.83,34.61 295.91,34.61 v295.59,34.29
  Top 1.27: C56.1 v289.37,37.65 288.61,38.42 288.61,44.13 292.73,48.26 C53.1 | C53.1 300.35,57.15 C51.+ 300.35,66.04 302.89,68.58 302.89,76.2 300.35,78.74 B3.+ | C58.+ C53.1
  Bottom 0.254: v295.59,34.29 291.46,34.29 289.56,36.2 289.56,37.47 v289.37,37.65
IN3  (via drill 0.61)
  Top 0.254: U$10.1 314.66,38.42 313.37,38.42 313.37,37.97 313.28,37.88 | 313.28,37.88 C64.1 313.55,37.16 U$10.3 | U$10.2 313.35,37.8 313.28,37.88 | U$10.4 313.38,36.51 313.05,36.83 313.28,37.05 313.28,37.88 | U$10.7 318.42,34.61 317.5,34.61 v317.18,34.29
  Top 1.27: C64.1 v310.96,37.65 310.2,38.42 310.2,44.13 314.32,48.26 C61.1 | C61.1 321.94,57.15 C59.+ 321.94,66.04 324.48,68.58 324.48,76.2 321.94,78.74 B5.+ | C67.+ C61.1
  Bottom 0.254: v317.18,34.29 313.05,34.29 311.15,36.2 311.15,37.47 v310.96,37.65
L
  Top 1.27: U$7.AC/L 29.87,200.94 62.47,233.54 U$5.L 62.47,243.22 58.42,247.27 24.13,247.27 21.57,244.71 | X10.3 21.57,244.71 | X11.3 8.89,228.22 17.78,228.22 21.57,232.01 21.57,244.71
N
  Bottom 1.27: X11.2 6.35,220.6 16.51,220.6 16.51,220.88 U$7.AC/N 22.58,226.95 | 22.58,226.95 45.72,226.95 56.47,237.7 U$5.N | X10.2 16.53,239.63 22.58,233.58 22.58,226.95
N$1  (1 unrouted)
N$2
  Top 1.016: IC4.2 IC4.1 IC2.9
N$3
  Bottom 1.016: IC4.6 IC4.7 337.18,165.1 333.38,161.29 IC2.16
N$4
  Top 1.016: IC3.2 IC3.1 IC1.9
N$5
  Bottom 1.016: IC1.16 306.7,160.02 IC3.7 IC3.6
N$6
  Bottom 1.016: Q3.B 167,46.99 | 167,46.99 161.92,46.99 161.92,52.07 Q14.C | 167,46.99 Q1.B Q1.C
N$7
  Top 0.508: IC1.7 321.94,152.4 329.06,152.4 | 329.06,152.4 338.45,152.4 IC2.3 | R1.1 329.06,152.4
N$8
  Bottom 1.016: Q1.E 164.46,53.34 169.54,53.34 D10.K
N$9
  Bottom 1.016: R6.2 335.91,195.58 R5.1 C5.1
N$10
  Bottom 1.016: 346.09,189.23 R7.2 | 346.09,189.23 346.09,194.31 347.34,194.31 C7.1 | R8.1 349.88,187.94 349.9,187.96 347.36,187.96 346.09,189.23
N$11
  Bottom 1.016: R9.1 378.46,191.79 378.48,191.77 385.42,191.77 385.44,191.79 R10.2 385.44,203.18 385.46,203.2 C11.1 381.65,203.2 381.65,215.9 R11.1 380.38,215.92 380.38,220.98 U$2.2
N$12
  Bottom 1.016: R5.2 335.91,199.41 335.93,199.39 343.55,199.39 | C6.1 343.53,199.37 343.55,199.39 | 362.6,198.12 IC8.8 360.04,199.39 343.55,199.39 | 362.6,198.12 IC8.7 D3.A | D2.C 362.6,201.28 362.6,198.12
N$13
  Bottom 1.016: D7.A IC8.4 IC8.11 351.81,190.5 | 351.17,190.5 R8.2 | 351.81,190.5 351.17,190.5 | C8.1 351.17,196.85 351.17,190.5 | 351.81,190.5 351.81,182.88 D6.C
N$14
  Top 1.016: K2.16 327.02,213.36 316.97,213.36 316.97,218.34 316.86,218.44 314.32,218.44 D1.A
  Bottom 1.016: U$2.1 376.57,223.52 372.76,227.33 372.76,228.6 320.69,228.6 315.61,223.52 315.61,220.98 D1.A
N$15
  Bottom 1.016: 363.88,220.98 IC7.8 357.52,220.98 357.52,215.9 354.98,215.9 | 363.88,220.98 IC7.7 D4.A | 354.98,215.9 C13.1 | R13.2 354.96,215.92 354.98,215.9 | D5.C 363.22,221 363.88,220.98
N$16
  Bottom 1.016: R15.2 335.91,210.8 335.93,213.36 343.55,213.36 | C15.1 343.58,213.38 343.55,213.36 | IC7.11 343.55,213.36 | D8.A 367.68,213.38 IC7.4 IC7.11 | D9.C 360.02,213.34 IC7.11
N$17  (via drill 0.35)
  Top 1.016: IC8.13 354.96,185.42 v354.96,205.74
  Bottom 1.016: 363.88,182.88 IC8.14 | 363.88,182.88 IC8.1 | IC8.13 363.88,185.42 | 363.88,185.42 IC8.2 372.75,185.42 372.75,182.88 R9.2 | 363.88,185.42 363.88,182.88 | 363.88,208.28 IC7.2 | 363.88,208.28 IC7.13 | 363.88,205.74 IC7.14 v354.96,205.74 | 363.88,205.74 363.88,208.28 | IC7.1 363.88,205.74
N$18
  Bottom 1.016: R16.2 Q3.E
N$19
  Bottom 1.016: R13.1 354.96,221 354.98,220.98 R12.2 351.15,219.69 348.63,217.17 348.61,217.17 C12.1
N$20
  Top 1.27: U$5.PE 27.27,219.93 22.84,215.5 X11.1 3.83,215.5 1.65,217.68 1.65,232.41 3.81,234.57 3.83,234.55 X10.1
N$21
  Bottom 1.016: 339.75,219.07 R14.2 | 339.75,219.07 339.09,219.07 R15.1 | C14.1 339.72,219.06 339.75,219.07
N$22
  Bottom 1.016: X5.2 325.73,221.02 325.77,220.98 324.5,220.98 324.5,209.55 K2.13
N$23
  Bottom 1.016: X5.1 320.65,221.02 321.92,221.02 321.96,220.98 321.96,209.55 K2.4
N$26
  Top 1.016: D27.C D25.C C36.2
  Bottom 1.016: R21.1 R16.1 D10.A 167,62.23 | 180.97,62.23 Q9.2 | D27.C 203.83,67.31 206.37,64.77 210.18,64.77 C38.2 | 167,62.23 174.62,62.23 | 174.62,62.23 180.97,62.23 | 167,62.23 C34.1 156.84,76.2 D17.C | C41.+ 180.97,62.23 | Q4.C 174.62,71.12 | 174.62,71.12 174.62,62.23 | C40.+ 174.62,71.12 | C36.2 180.97,62.23
N$27
  Bottom 1.016: Q9.1 175.89,57.15 D12.C 173.35,52.07 C4.+ | C4.+ 173.35,44.45 Q3.C | C3.1 C4.+
N$28
  Bottom 1.016: R18.1 D12.A 178.43,52.07 C4.- C3.2
N$29
  Bottom 1.016: Q6.E R18.2
N$30
  Bottom 0.813: Q14.E R17.1
N$31
  Bottom 1.016: D14.A 156.84,43.18 R21.2 158.11,49.53 Q14.B
N$32
  Bottom 1.016: Q13.E R20.2
N$33
  Bottom 1.016: Q13.B 252.09,50.8 R22.1 253.36,44.45 D13.K
N$34
  Bottom 1.016: Q11.E R23.1
N$35
  Bottom 1.016: R23.2 D15.C 224.15,49.53 231.77,49.53 C16.+ C17.1
N$36
  Bottom 1.016: Q5.1 226.69,52.07 D15.A 236.85,52.07 C16.- 236.85,44.45 | 236.85,44.45 Q10\.C | 236.85,44.45 C17.2
N$37
  Bottom 1.016: 243.2,46.99 Q2.B Q2.C | 243.2,46.99 Q10\.B | Q13.C 248.28,53.34 248.28,46.99 243.2,46.99
N$38
  Bottom 1.016: R19.1 Q10\.E
N$39
  Bottom 1.016: Q2.E 245.74,53.34 240.66,53.34 D11.A
N$40
  Top 1.016: Q5.3 231.77,63.5 220.34,63.5 220.34,83.82 229.88,83.82 Q7.B
N$41
  Top 1.016: Q4.B 170.81,84.07 170.81,80.01 173.35,80.01 173.35,60.96 183.51,60.96 Q9.3
N$42
  Bottom 1.016: R25.1 197.17,49.53 C20.2 C20.3 IC5.6
N$43
  Bottom 1.016: R24.1 213.04,49.53 C23.3 | C23.2 C23.3 | IC6.6 C23.3
N$44
  Bottom 1.016: Q11.B 210.18,54.61 210.18,49.53 R24.2
N$45
  Bottom 1.016: R25.2 200.02,49.53 200.02,54.61 Q6.B
N$46
  Top 0.813: IC5.2 197.17,35.88 193.04,40.01 193.04,44.13 C20.1
  Top 1.016: C25.- 182.24,15.24 182.24,24.13 R27.1
  Bottom 1.016: IC5.2 197.17,31.75 D22.A D23.C 192.09,24.13 R26.2 R27.1
N$47
  Bottom 1.016: Q8.2 165.73,29.21 164.46,29.21 D19.6 164.46,34.29 173.35,34.29 R34.2 179.7,27.94 R30.1
N$48
  Bottom 1.016: D23.A D22.C IC5.3 199.71,38.1 182.24,38.1 | C18.+ 182.24,38.1 | R34.1 182.24,31.75 C19.2 182.24,38.1
N$49
  Bottom 1.016: C22.- 227.96,38.1 | D21.C D20.A 213.04,31.75 IC6.3 213.04,38.1 227.96,38.1 | R35.1 227.96,31.75 C21.2 227.96,38.1
N$50
  Bottom 1.016: D18.4 240.66,35.56 | 240.66,35.56 234.31,35.56 R35.2 | 240.66,35.56 250.82,35.56 250.82,26.03 Q12.1
N$51
  Top 0.813: IC6.2 210.5,35.24 206.37,39.37 206.37,44.13 C23.1
  Top 1.016: C24.+ 227.96,15.24 227.96,24.13 R28.2
  Bottom 1.016: IC6.2 D20.C D21.A 213.99,29.21 213.99,24.13 R29.1 R28.2
N$52
  Bottom 1.27: Q12.3 238.76,26.03 R31.2
N$53
  Bottom 1.27: Q8.3 170.18,26.03 R30.2
N$54
  Bottom 0.813: D24.K 207.64,17.78 R33.2 207.62,15.22 X14.2
N$55
  Top 0.813: R32.1 202.56,6.4 X14.1
  Bottom 0.813: R32.1 202.56,17.78 D24.A
N$56
  Top 1.016: D26.A D28.A C37.1
  Bottom 1.016: C39.1 200.02,69.85 203.83,69.85 206.37,72.39 D28.A | R22.2 R19.2 | R19.2 D11.K | 235.58,62.23 235.58,54.61 229.23,54.61 Q5.2 229.23,67.31 C42.- 217.8,67.31 217.8,72.39 C37.1 | 248.28,62.23 R19.2 | 235.58,62.23 243.2,62.23 | 243.2,62.23 248.28,62.23 | 248.28,62.23 C33.2 252.09,76.2 D16.A | C43.- 243.2,62.23 | 235.58,62.23 Q7.C
N$57
  Top 0.61: C39.2 D28.C
  Top 1.016: D25.A 207.01,62.23 204.47,64.77 204.47,70.48 D28.C
  Bottom 1.016: C36.1 200.02,64.77 203.83,64.77 206.37,62.23 D25.A
  Bottom 1.676: X16.1 212.75,83.84 210.18,81.28 207.64,81.28 205.1,78.74 205.1,73.66 203.83,72.39 D28.C
N$58
  Top 1.016: C38.1 D27.A 206.06,68.9 206.06,75.25 203.83,77.47 D26.C 202.56,78.74 203.83,80.01 211.45,80.01 212.72,78.74 C37.2
  Top 1.676: X15.2 197.51,81.3 197.48,81.28 201.29,77.47 D26.C
N$59
  Top 0.254: U$4.10 276.46,37.16 276.86,37.56 276.86,40.63 U$6.3
N$60
  Top 0.254: U$4.6 270.79,35.21 269.64,34.06 R37.2
N$61
  Bottom 1.27: B1.AC2 271.12,78.76 X17.1
N$62
  Bottom 1.27: B1.AC1 280.03,77.47 280.03,83.82 278.76,85.09 276.22,85.09 X17.2
N$63
  Top 0.254: U$8.10 298.05,37.16 298.45,37.56 298.45,40.63 U$9.3
N$64
  Top 0.254: U$8.6 292.38,35.21 291.23,34.06 R39.2
N$65
  Bottom 1.27: B3.AC2 292.71,78.76 X19.1
N$66
  Bottom 1.27: B3.AC1 301.62,77.47 301.62,83.82 300.35,85.09 297.81,85.09 X19.2
N$67
  Top 0.254: U$10.10 319.64,37.16 320.04,37.56 320.04,40.63 U$11.3
N$68
  Top 0.254: U$10.6 313.97,35.21 312.82,34.06 R41.2
N$69
  Bottom 1.27: B5.AC2 314.3,78.76 X21.1
N$70
  Bottom 1.27: X21.2 319.4,85.09 316.86,82.55 316.86,76.2 B5.AC1
N$71  (via drill 3.5)
  other vias: 150.41,86
N$72  (via drill 3.5 pad 1.1)
  other vias: 260.68,86
N$73  (via drill 3.5 pad 1.1)
  other vias: 150.41,5
N$74  (via drill 3.5 pad 1.1)
  other vias: 260.68,5
N$75  (via drill 3.5)
  other vias: 326.6,5
N$76  (via drill 3.5)
  other vias: 326.6,86
OUT1  (via drill 0.4, 0.61)  (8 unrouted)
  Top 0.254: U$4.11 U$4.12 275.83,39.44 v275.59,39.69
  Top 1.27: C48.+ 277.47,17.76 X18.2
  Bottom 1.27: C69.+ 277.49,21.38 C48.+
  other vias: 276.86,44.13 275.59,44.13 278.13,30.8
  pour Top (no thermals): 274.95,39.05 274.95,44.77 277.49,44.77 277.49,39.05
  pour Bottom: 274.95,45.09 277.81,45.09 277.81,35.56 279.08,34.29 279.08,30.16 276.86,30.16 276.86,38.73 274.95,38.73
  pour Top: 277.18,33.97 277.18,31.43 275.27,29.53 275.27,2.86 285.11,2.86 285.11,33.97
OUT2  (via drill 0.4, 0.61)  (7 unrouted)
  Top 0.254: U$8.11 U$8.12 297.42,39.44 v297.18,39.69
  Top 1.27: C55.+ 299.06,17.76 X20.2
  Bottom 1.27: C70.+ 299.08,21.38 C55.+
  other vias: 298.45,44.13 297.18,44.13 299.72,30.8
  pour Top (no thermals): 296.54,39.05 296.54,44.77 299.08,44.77 299.08,39.05
  pour Bottom: 296.54,45.09 299.4,45.09 299.4,35.56 300.67,34.29 300.67,30.16 298.45,30.16 298.45,38.73 296.54,38.73
  pour Top: 298.77,33.97 298.77,31.43 296.86,29.53 296.86,2.86 306.7,2.86 306.7,33.97
OUT3  (via drill 0.4, 0.61)  (7 unrouted)
  Top 0.254: U$10.11 U$10.12 319.01,39.44 v318.77,39.69
  Top 1.27: C63.+ 320.65,17.76 X22.2
  Bottom 1.016: 320.67,21.38 C63.+
  Bottom 1.27: C68.+ 320.67,21.38
  other vias: 320.04,44.13 318.77,44.13 321.31,30.8
  pour Top (no thermals): 318.13,39.05 318.13,44.77 320.67,44.77 320.67,39.05
  pour Bottom: 318.13,45.09 320.99,45.09 320.99,35.56 322.26,34.29 322.26,30.16 320.04,30.16 320.04,38.73 318.13,38.73
  pour Top: 320.36,33.97 320.36,31.43 318.45,29.53 318.45,2.86 323.6,2.86 323.53,10.16 328.29,10.16 328.29,33.97
PGA_CS
  Bottom 0.508: IC1.2 310.51,151.13 334.64,151.13 IC2.2
PGA_LEFT+
  Bottom 1.016: X6.2 320.7,174.01 320.67,173.99 321.94,172.72 321.94,161.29 319.4,158.75 IC1.11
PGA_LEFT-
  Bottom 1.016: X6.4 310.54,175.28 310.51,175.26 315.59,170.18 315.59,161.29 314.32,160.02 313.05,160.02 311.78,158.75 IC1.14
PGA_RIGHT+
  Bottom 1.016: X7.2 347.37,176.55 343.53,172.72 343.53,160.02 IC2.11
PGA_RIGHT-
  Bottom 1.016: IC2.14 338.45,158.75 341,161.29 341,172.72 337.18,176.53 337.18,177.75 X7.4
PGA_SCLK
  Top 0.508: IC2.6 346.07,148.59 343.53,146.05 320.67,146.05 319.4,147.32 IC1.6
R-2R_LEFT+  (2 unrouted)
  Top 1.016: JP3.13 JP3.14 305.44,203.69 305.44,191.77 298.07,184.4 298.07,173.74 311.53,160.27 314.45,160.27 315.98,161.8 315.98,164.21 IC3.3
R-2R_LEFT-  (2 unrouted)
  Top 1.016: JP3.15 JP3.16
  Bottom 1.016: JP3.16 303.38,203.2 303.38,190.99 299.08,186.69 299.08,173.99 302.89,170.18 IC3.5
R-2R_RIGHT+  (2 unrouted)
  Top 1.016: JP3.7 JP3.8 299.57,218.44 308.23,209.79 308.23,190.5 299.59,181.86 299.59,175.01 302.26,172.34 323.6,172.34 335.28,160.66 340.36,160.66 342.26,162.56 342.26,165.1 344.8,167.64 IC4.3
R-2R_RIGHT-  (2 unrouted)
  Top 1.016: JP3.5 JP3.6 299.57,220.98 310.51,210.04 310.51,189.23 301.62,180.34 301.62,175.26 302.89,173.99 334.64,173.99 IC4.5
RXD  (1 unrouted)
  Top 0.508: PCB2.P$8 138.19,190.12 143.51,190.12 144.78,191.39 144.78,200.3 JP5.9
SET1  (2 unrouted)
  Top 0.254: U$4.8 277.2,35.86
  pour Top (no thermals): 276.54,36.2 278.45,38.1 283.21,38.1 283.21,34.92 277.18,34.92 276.54,35.56
SET2  (2 unrouted)
  Top 0.254: U$8.8 298.79,35.86
  pour Top (no thermals): 298.13,36.2 300.04,38.1 304.8,38.1 304.8,34.92 298.77,34.92 298.13,35.56
SET3  (2 unrouted)
  Top 0.254: U$10.8 320.38,35.86
  pour Top (no thermals): 319.72,36.2 321.63,38.1 326.39,38.1 326.39,34.92 320.36,34.92 319.72,35.56
SGND1  (2 unrouted)
  pour Top (rank 2, no thermals): 274.95,41.91 271.14,41.91 271.14,45.72 283.21,45.72 283.21,38.42 277.81,38.42 277.81,45.09 274.95,45.09
SGND2  (2 unrouted)
  pour Top (rank 2, no thermals): 296.54,41.91 292.73,41.91 292.73,45.72 304.8,45.72 304.8,38.42 299.4,38.42 299.4,45.09 296.54,45.09
SGND3  (2 unrouted)
  pour Top (rank 2, no thermals): 318.13,41.91 314.32,41.91 314.32,45.72 326.39,45.72 326.39,38.42 320.99,38.42 320.99,45.09 318.13,45.09
TXD  (1 unrouted)
  Bottom 0.508: PCB2.P$10 138.18,196.84 138.18,199.75 JP5.10
V+
  Bottom 0.813: 189.86,20.32 R32.2
  Bottom 1.016: R27.2 C25.+ C26.2 189.86,20.32 201.29,20.32 201.29,26.67 204.15,29.53 204.15,40.64 197.48,40.64 | Q8.1 163.19,17.78 | D17.A 149.22,68.58 | C31.2 197.48,40.64 | IC5.7 197.17,40.96 197.48,40.64
  Bottom 1.676: C25.+ 174.62,20.32 172.08,17.78
  Bottom 1.778: Q4.E 184.78,84.07 C35.1
  Bottom 1.93: X9.1 187.3,3.2 187.32,3.17 | 187.32,3.17 173.35,3.17 172.08,4.45 172.08,6.35 X13.1 172.08,7.64 172.08,17.78 163.19,17.78 C27.+ 149.22,17.78 149.22,68.58 149.22,80.01 156.84,80.01 156.84,88.9 180.34,88.9 180.34,84.34 Q4.E | X8.1 212.7,3.2 212.72,3.17 | 212.72,3.17 226.69,3.17 227.94,4.42 X4.1 | 212.72,3.17 187.32,3.17
V-
  Top 1.016: C30.1 219.07,39.37 217.8,38.1 215.58,38.1 IC6.4
  Top 1.93: X13.3 182.22,4.47 183.51,3.17 197.48,3.17 | 197.48,3.17 222.88,3.17 | 222.88,3.17 236.22,3.17 238.12,5.08 238.12,6.35 X4.3 | X8.3 222.86,3.2 222.88,3.17 | X9.3 197.46,3.2 197.48,3.17
  Bottom 0.813: R33.1 220.34,20.3
  Bottom 1.016: Q12.2 244.47,17.78 | R28.1 C24.- C29.1 224.15,20.32 | D16.C 260.98,68.58 | 224.15,20.32 R31.1 | C30.1 205.74,40.64 205.74,29.53 208.6,26.67 208.6,20.64 208.91,20.32 220.34,20.32 | 224.15,20.32 220.34,20.32 | 220.34,20.3 220.34,20.32
  Bottom 1.676: C24.- 235.58,20.32 238.12,17.78
  Bottom 1.778: C32.2 246.13,84.07 Q7.E
  Bottom 1.93: X4.3 238.12,6.38 238.12,17.78 244.47,17.78 C28.- 260.98,17.78 260.98,68.58 260.98,80.01 241.3,80.01 241.3,83.81 Q7.E
(copper drawn outside any net)
  shapes: Top area x5

## Text on the board
tPlace: L | N | G | DD21 | L | N | G | IRM-15-5 | 5V | INPUT<14VAC | INPUT<14VAC | AC-IN | AC_IN | AC_IN | AC_IN | 1N4007 | 1N4007 | PNP | NPN | PNP | NPN | NPN | PNP | Rset | Cset | Rset | Cset | Rset | Cset | RED | RED | R_IL | R_IL | R_IL | LED | - | - | - | -
bPlace: Vout=LT1021*[1+(R1/R2)] | NPN=KSP42 / PNP=KSP92 / Zener=Vout/2 | Vout Rset / 2.5 24.9k / 3.3 33.2k / 5 49.9k / 12 121k / 15 150k
tNames: 1N4148 | + | G | + | G | + | G | + | G